# EAGLE design Inversor (EAGLE 7.6.0)
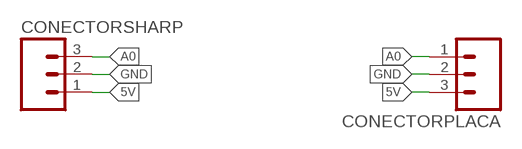
[diagram p0: schematic, sheet 1]

## Parts
CONECTORPLACA  M03PTH  [1X03]
CONECTORSHARP  M03JST-PTH-VERT  [JST-3-PTH-VERT]

## Nets
5V: CONECTORPLACA.3 CONECTORSHARP.1
A0: CONECTORPLACA.1 CONECTORSHARP.3
GND: CONECTORPLACA.2 CONECTORSHARP.2

## Library data of the parts
CONECTORPLACA CONECTORSHARP = SparkFun-Connectors:M03: Header 3 Standard 3-pin 0.1" header. Use with straight break away headers (SKU : PRT-00116), right angle break away headers (PRT-00553), swiss pins (PRT-00743), machine pins (PRT-00117), and female headers (PRT-00115). Molex polarized connector foot print use with SKU : PRT-08232 with associated crimp pins and housings.

## Board
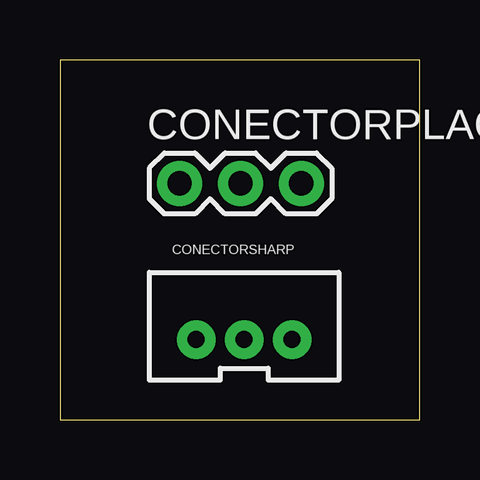
[diagram p1: board, top side]
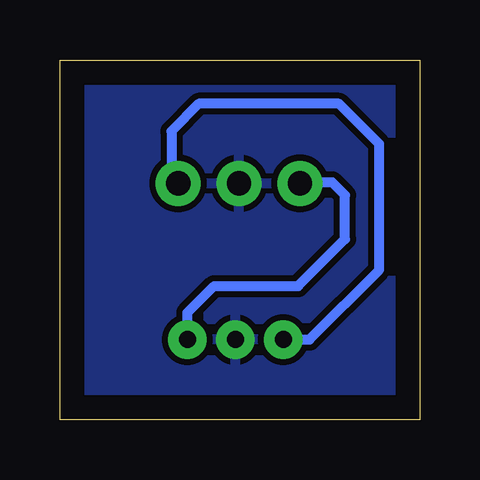
[diagram p2: board, bottom side, seen from below]

Size 15 x 15 mm. Coordinates in mm from the lower left corner, seen from the top.
Outline: 0,0 15,0 15,15 0,15 0,0
Copper layers (1*16): Top 0.035mm / dielectric 1.5mm / Bottom 0.035mm
Design rules "default": minimum track width 10mil, minimum drill 24mil, track to track 8mil, track to pad 8mil, pad to pad 8mil, via to via 8mil, smd to smd 8mil, copper to edge 40mil, drill to drill 8mil, minimum pad ring 10mil, minimum via ring 8mil, stop-mask expansion 4mil, vias tented up to drill 0mil, thermal gap 10mil

### Footprints (pad centres in the part's own frame; a part is rotated, then mirrored left to right if it is on the bottom)
1X03 = drill 1.016 pad 1.88: 1 0,0; 2 2.54,0; 3 5.08,0
JST-3-PTH-VERT = drill 0.7 pad 1.6: 1 -2,-0.55; 2 0,-0.55; 3 2,-0.55

### Placement (x,y rotation side)
CONECTORPLACA  4.99,9.85 0 top
CONECTORSHARP  7.68,3.89 0 top

### Tracks (layer width: path | path; a pad name or v marks a point on that pad's centre or on a via)
5V
  Bottom 0.406: CONECTORSHARP.1 4.59,3.34 1.68,6.25 1.68,11.49 3.36,13.17 9.21,13.17 10.35,12.03 10.35,10.13 CONECTORPLACA.3
A0
  Bottom 0.406: CONECTORSHARP.3 9.68,4.46 8.57,5.57 5.07,5.57 3.11,7.53 3.11,9.36 3.64,9.89 4.95,9.89 CONECTORPLACA.1
GND
  pour Bottom (isolate 0.254): 0,0 15,0 15,15 0,15